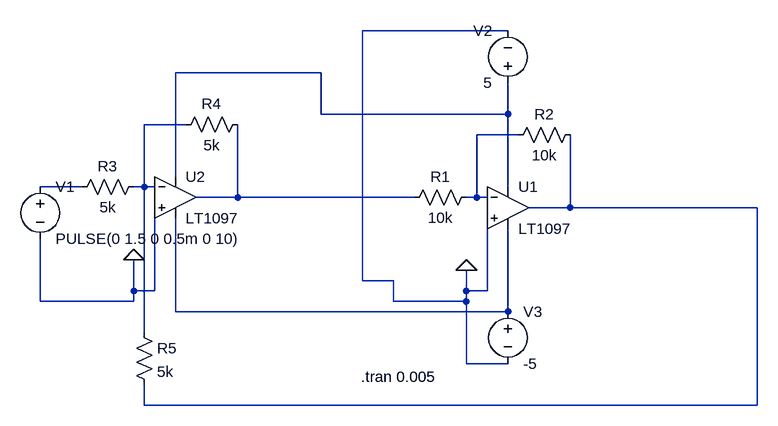
[diagram p0: schematic p control.asc]
p control.asc, the LTspice schematic file:
Version 4
SHEET 1 1048 680
WIRE 240 -96 16 -96
WIRE -48 -32 -272 -32
WIRE -48 32 -48 -32
WIRE 240 32 240 -16
WIRE 240 32 -48 32
WIRE -256 48 -320 48
WIRE 256 64 192 64
WIRE -272 128 -272 -32
WIRE -416 144 -480 144
WIRE -320 144 -320 48
WIRE -320 144 -336 144
WIRE -304 144 -320 144
WIRE 240 144 240 32
WIRE -176 160 -176 48
WIRE -176 160 -240 160
WIRE 96 160 -176 160
WIRE 192 160 192 64
WIRE 192 160 176 160
WIRE 208 160 192 160
WIRE 336 176 336 64
WIRE 336 176 272 176
WIRE 624 176 336 176
WIRE 16 288 16 -96
WIRE 64 288 16 288
WIRE -336 304 -336 256
WIRE -304 304 -304 176
WIRE -304 304 -336 304
WIRE 176 304 176 272
WIRE 208 304 208 192
WIRE 208 304 176 304
WIRE -480 320 -480 224
WIRE -336 320 -336 304
WIRE -336 320 -480 320
WIRE 64 320 64 288
WIRE 176 320 176 304
WIRE 176 320 64 320
WIRE -272 336 -272 192
WIRE 240 336 240 208
WIRE 240 336 -272 336
WIRE -320 368 -320 144
WIRE 176 416 176 320
WIRE 240 416 176 416
WIRE -320 480 -320 448
WIRE 624 480 624 176
WIRE 624 480 -320 480
FLAG 176 272 0
FLAG -336 256 0
SYMBOL res 192 144 R90
WINDOW 0 0 56 VBottom 2
WINDOW 3 32 56 VTop 2
SYMATTR InstName R1
SYMATTR Value 10k
SYMBOL res 352 48 R90
WINDOW 0 0 56 VBottom 2
WINDOW 3 32 56 VTop 2
SYMATTR InstName R2
SYMATTR Value 10k
SYMBOL Opamps\\LT1097 240 112 R0
SYMATTR InstName U1
SYMBOL voltage -480 128 R0
WINDOW 123 0 0 Left 0
WINDOW 39 0 0 Left 0
SYMATTR InstName V1
SYMATTR Value PULSE(0 1.5 0 0.5m 0 10)
SYMBOL voltage 240 0 R180
WINDOW 0 24 96 Left 2
WINDOW 3 24 16 Left 2
WINDOW 123 0 0 Left 0
WINDOW 39 0 0 Left 0
SYMATTR InstName V2
SYMATTR Value 5
SYMBOL voltage 240 320 R0
WINDOW 123 0 0 Left 0
WINDOW 39 0 0 Left 0
SYMATTR InstName V3
SYMATTR Value -5
SYMBOL res -320 128 R90
WINDOW 0 0 56 VBottom 2
WINDOW 3 32 56 VTop 2
SYMATTR InstName R3
SYMATTR Value 5k
SYMBOL res -160 32 R90
WINDOW 0 0 56 VBottom 2
WINDOW 3 32 56 VTop 2
SYMATTR InstName R4
SYMATTR Value 5k
SYMBOL Opamps\\LT1097 -272 96 R0
SYMATTR InstName U2
SYMBOL res -336 352 R0
SYMATTR InstName R5
SYMATTR Value 5k
TEXT 14 436 Left 2 !.tran 0.005

The netlist it stands for:
* p control.asc
R1 N003 N005 10k
R2 N006 N003 10k
XU1 0 N003 N001 N007 N006 LT1097  ; pins In+ In- V+ V- OUT
V1 N004 0 PULSE(0 1.5 0 0.5m 0 10)
V2 N001 0 5
V3 N007 0 -5
R3 N002 N004 5k
R4 N005 N002 5k
XU2 0 N002 N001 N007 N005 LT1097  ; pins In+ In- V+ V- OUT
R5 N002 N006 5k
.tran 0.005
.backanno
.end